# Altium project inflarrojo.PrjPcb
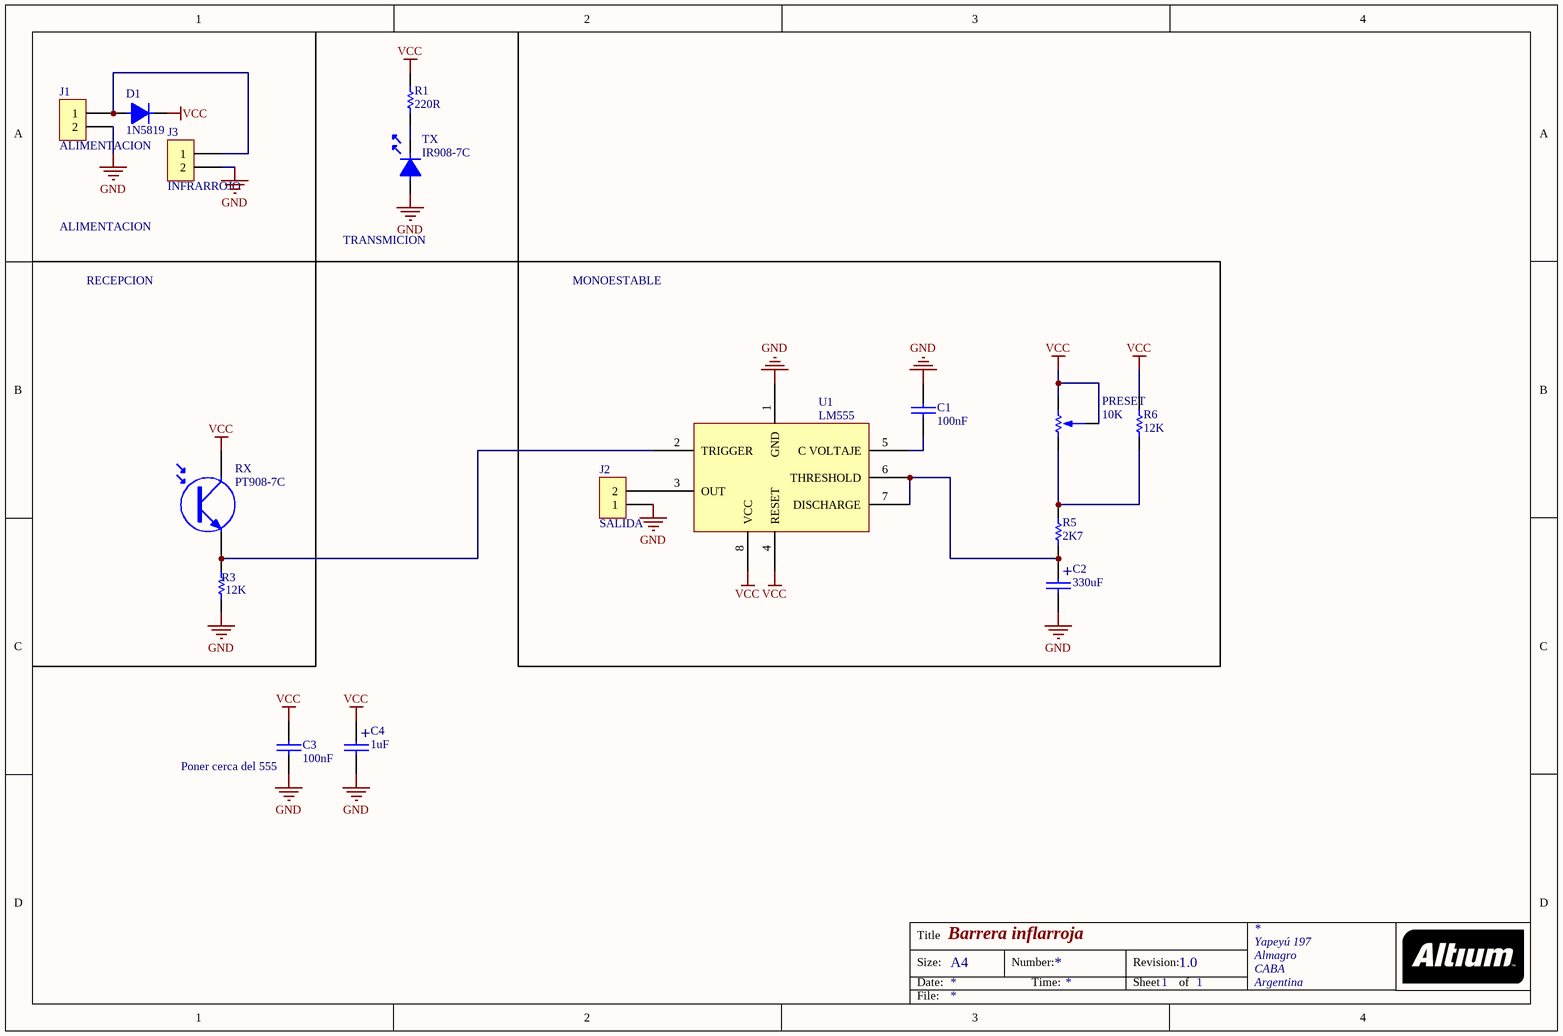
[diagram p0: Inflarrojo (2).SchDoc]
1 sheet, 16 parts. Net scope: global (net labels, ports and power ports of the same name join across sheets).
Board files: Inflarrojo (1).PcbDoc, PANEL.PcbDoc

## Sheet Inflarrojo (2).SchDoc: Barrera inflarroja
size A4; DrawnBy: Grupo 8; Address1: Yapeyú 197; Address2: Almagro; Address3: CABA; Address4: Argentina; Revision: 1.0; SheetNumber: 1; SheetTotal: 1

### Parts
C1  100nF  [CAP200]
C2  330uF  [CAP200RP]
C3  100nF  [CAP200]
C4  1uF  [CAP100RP]
D1  1N5819  [DO41]
J1  ALIMENTACION  [BORNERA2]
J2  SALIDA  [BORNERA2]
J3  INFRARROJO  [BORNERA2]
PRESET  10K  [PRESET H]
R1  220R  [RES400]
R3  12K  [RES400]
R5  2K7  [RES400]
R6  12K  [RES400]
RX  PT908-7C  [pototransistor]
TX  IR908-7C  [fotodiodo]
U1  LM555  [DIP8]

### Blocks framed on the sheet
MONOESTABLE: C1 C2 J2 PRESET R5 R6 U1

### Nets
GND: C1.1 C2.2 C3.2 C4.2 J1.2 J2.1 J3.2 R3.1 TX.1 U1.1(GND)
VCC: C3.1 C4.1 D1.2 PRESET.1 PRESET.2 R1.2 R6.2 RX.2(C) U1.4(RESET) U1.8(VCC)
NetC1_2: C1.2 U1.5(C_VOLTAJE)
NetC2_1: C2.1 R5.1 U1.6(THRESHOLD) U1.7(DISCHARGE)
NetD1_1: D1.1 J1.1 J3.1
NetJ2_2: J2.2 U1.3(OUT)
NetPRESET_3: PRESET.3 R5.2 R6.1
NetR1_1: R1.1 TX.2
NetR3_2: R3.2 RX.1(E) U1.2(TRIGGER)

### Notes on the sheet
- ALIMENTACION
- TRANSMICION
- RECEPCION
- (near C3) Poner cerca del 555
- Title
- Size:
- Date:
- A4
- Number:
- Time:
- Revision:
- Sheet
- of
- File:
- (in symbol CAPPOL) +

### Library data of the parts
C1 C3 = CAP
C2 C4 = CAPPOL
D1 = DIODO
J1-J3 = BORNERA 2
PRESET = PRESET
R1 R3 R5 R6 = RES
RX = PT908-7C: fototransistor
TX = IR908-7C: Led infrarrojo
U1 = LM555: Timer